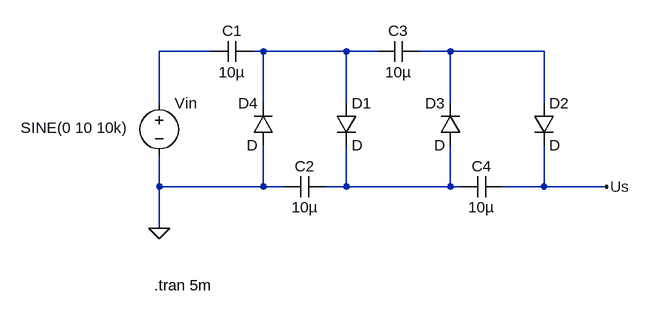
[diagram p0: schematic multiplicateur_tension_x5_10uF (cascade de villard).asc]
multiplicateur_tension_x5_10uF (cascade de villard).asc, the LTspice schematic file:
Version 4
SHEET 1 880 680
WIRE 192 224 112 224
WIRE 272 224 256 224
WIRE 400 224 272 224
WIRE 448 224 400 224
WIRE 560 224 512 224
WIRE 704 224 560 224
WIRE 112 304 112 224
WIRE 272 304 272 224
WIRE 400 304 400 224
WIRE 560 304 560 224
WIRE 704 304 704 224
WIRE 112 432 112 384
WIRE 272 432 272 368
WIRE 272 432 112 432
WIRE 304 432 272 432
WIRE 400 432 400 368
WIRE 400 432 368 432
WIRE 560 432 560 368
WIRE 560 432 400 432
WIRE 576 432 560 432
WIRE 704 432 704 368
WIRE 704 432 640 432
WIRE 800 432 704 432
WIRE 112 496 112 432
FLAG 112 496 0
FLAG 800 432 Us
SYMBOL voltage 112 288 R0
WINDOW 3 -213 53 Left 2
SYMATTR Value SINE(0 10 10k)
SYMATTR InstName Vin
SYMBOL cap 256 208 R90
WINDOW 0 0 32 VBottom 2
WINDOW 3 32 32 VTop 2
SYMATTR InstName C1
SYMATTR Value 10µ
SYMBOL cap 368 416 R90
WINDOW 0 0 32 VBottom 2
WINDOW 3 32 32 VTop 2
SYMATTR InstName C2
SYMATTR Value 10µ
SYMBOL cap 512 208 R90
WINDOW 0 0 32 VBottom 2
WINDOW 3 32 32 VTop 2
SYMATTR InstName C3
SYMATTR Value 10µ
SYMBOL cap 640 416 R90
WINDOW 0 0 32 VBottom 2
WINDOW 3 32 32 VTop 2
SYMATTR InstName C4
SYMATTR Value 10µ
SYMBOL diode 384 304 R0
SYMATTR InstName D1
SYMBOL diode 688 304 R0
SYMATTR InstName D2
SYMBOL diode 576 368 R180
WINDOW 0 24 64 Left 2
WINDOW 3 24 0 Left 2
SYMATTR InstName D3
SYMBOL diode 288 368 R180
WINDOW 0 24 64 Left 2
WINDOW 3 24 0 Left 2
SYMATTR InstName D4
TEXT 104 584 Left 2 !.tran 5m

The netlist it stands for:
* multiplicateur_tension_x5_10uF (cascade de villard).asc
Vin N001 0 SINE(0 10 10k)
C1 N002 N001 10µ
C2 N004 0 10µ
C3 N003 N002 10µ
C4 Us N004 10µ
D1 N002 N004 D
D2 N003 Us D
D3 N004 N003 D
D4 0 N002 D
.model D D
.lib standard.dio
.tran 5m
.backanno
.end